# Altium schematic sheet 12V_to_5V.SchDoc: 12V to 5V Converter
size B; DocumentNumber: 37; SheetNumber: 37; SheetTotal: 46
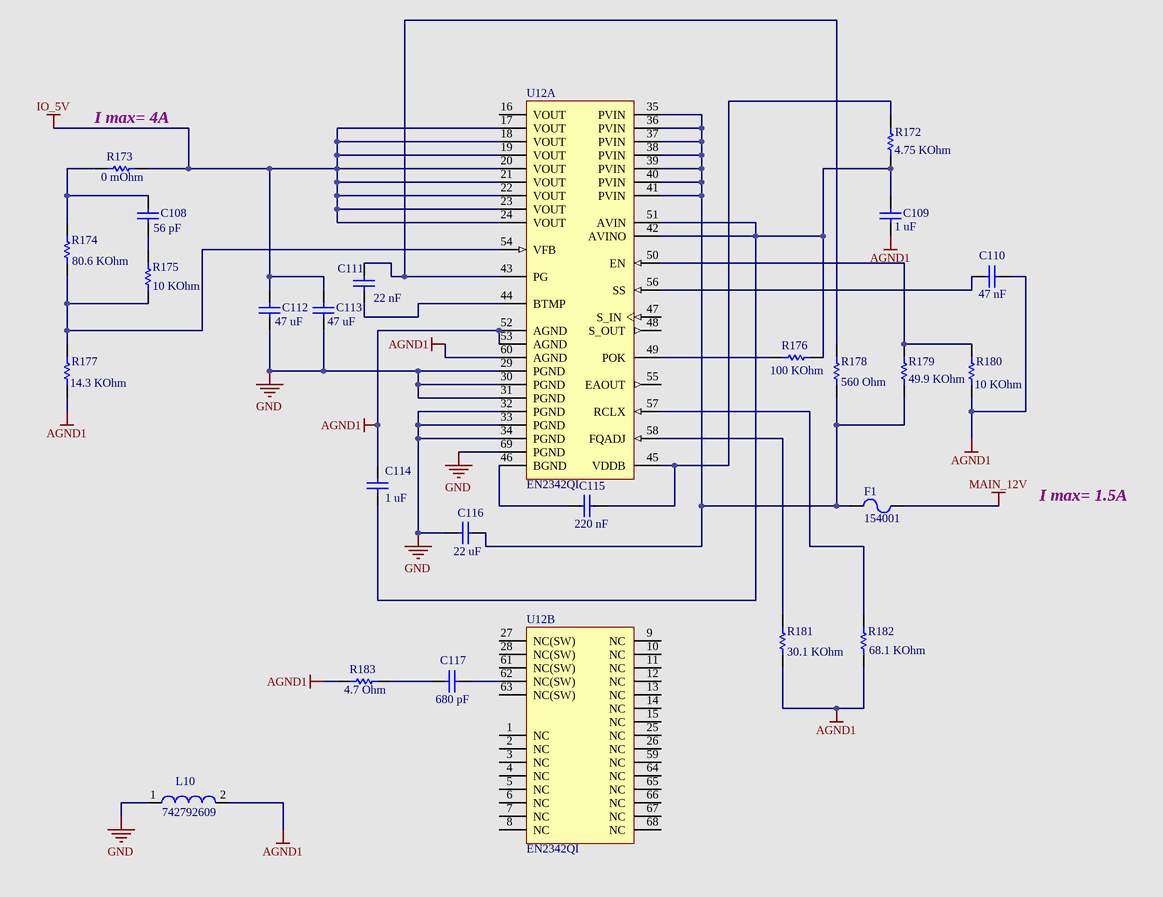
[diagram p0: 12V_to_5V.SchDoc]

## Parts
(Parts that share a designator on the sheet are numbered #1, #2 ... from top to bottom, then left to right.)
C108  Capacitance: 56 pF  [CAPC1005X33X20ML05T10]  (hidden comment: GRM1535C1H560JDD5D)
C109  Capacitance: 1 uF  [CAPC1005X33X10LL5]  (hidden comment: CGB2A1X5R1E105K033BC)
C110  Capacitance: 47 nF  [CAPC1005X55X25NL05T10]  (hidden comment: GRM155R71E473KA88D)
C111  Capacitance: 22 nF  [CAPC1005X55X25ML05T10]  (hidden comment: GRM155R71E223KA61D)
C112  Capacitance: 47 uF  [CAPC3216X180X20ML20]  (hidden comment: C3216X5R1A476M160AB)
C113  Capacitance: 47 uF  [CAPC3216X180X20ML20]  (hidden comment: C3216X5R1A476M160AB)
C114  Capacitance: 1 uF  [CAPC1005X33X10LL5]  (hidden comment: CGB2A1X5R1E105K033BC)
C115  Capacitance: 220 nF  [CAPC1005X55X25NL05T10]  (hidden comment: GRM155R61A224KE19D)
C116  Capacitance: 22 uF  [CAPC3216X180X55ML20T25]  (hidden comment: GRM31CR61E226KE15L)
C117  Capacitance: 680 pF  [CAPC1005X55X25ML05T10]  (hidden comment: GRM155R71H681KA01D)
F1  154001  [LFUS-0154001.DR_V]
L10  742792609  [SMD-0603]
R172  Resistance: 4.75 KOhm  [RESC1005X40X25ML05T05]  (hidden comment: ERJ-2RKF4751X)
R173  Resistance: 0 mOhm  [RESC1005X40X25ML05T05]  (hidden comment: ERJ-2GE0R00X)
R174  Resistance: 80.6 KOhm  [RESC1005X40X25ML05T05]  (hidden comment: ERJ-2RKF8062X)
R175  Resistance: 10 KOhm  [RESC1005X40X25NL05T05]  (hidden comment: ERJ-2RKF1002X)
R176  Resistance: 100 KOhm  [RESC1005X40X25LL05T05]  (hidden comment: ERJ-2RKF1003X)
R177  Resistance: 14.3 KOhm  [RESC1005X40X25LL05T05]  (hidden comment: ERJ-2RKF1432X)
R178  Resistance: 560 Ohm  [RESC1005X40X25ML05T05]  (hidden comment: ERJ-2GEJ561x)
R179  Resistance: 49.9 KOhm  [RESC1005X40X25LL05T05]  (hidden comment: ERJ-2RKF4992X)
R180  Resistance: 10 KOhm  [RESC1005X40X25NL05T05]  (hidden comment: ERJ-2RKF1002X)
R181  Resistance: 30.1 KOhm  [RESC1005X40X25LL05T05]  (hidden comment: CRCW040230K1FKED)
R182  Resistance: 68.1 KOhm  [RESC1005X40X25LL05T05]  (hidden comment: ERJ-2RKF6812X)
R183  Resistance: 4.7 Ohm  [RESC2013X70X40LL20T20]  (hidden comment: ERJ-6RQF4R7V)
U12#1  EN2342QI  [ALTR-QFN-68_A-305_D1-210_V]  (part A of 2)
U12#2  EN2342QI  [ALTR-QFN-68_A-305_D1-210_V]  (part B of 2)

## Nets
AGND1: C109.1 C110.1 C114.2 L10.2 R177.1 R180.1 R181.1 R182.1 R183.1 U12#1.52(AGND) U12#1.53(AGND) U12#1.60(AGND)
GND: C112.1 C113.1 C116.1 L10.1 U12#1.29(PGND) U12#1.30(PGND) U12#1.31(PGND) U12#1.32(PGND) U12#1.33(PGND) U12#1.34(PGND) U12#1.69(PGND)
IO_5V: C112.2 C113.2 R173.2 U12#1.17(VOUT) U12#1.18(VOUT) U12#1.19(VOUT) U12#1.20(VOUT) U12#1.21(VOUT) U12#1.22(VOUT) U12#1.23(VOUT) U12#1.24(VOUT)
MAIN_12V: F1.2
NetC108_1: C108.1 R175.2
NetC108_2: C108.2 R173.1 R174.2
NetC109_2: C109.2 C114.1 R172.1 R176.2 U12#1.42(AVINO) U12#1.51(AVIN)
NetC110_2: C110.2 U12#1.56(SS)
NetC111_1: C111.1 U12#1.44(BTMP)
NetC111_2: C111.2 R178.2 U12#1.43(PG)
NetC115_1: C115.1 U12#1.46(BGND)
NetC115_2: C115.2 R172.2 U12#1.45(VDDB)
NetC116_2: C116.2 F1.1 R178.1 R179.1 U12#1.35(PVIN) U12#1.36(PVIN) U12#1.37(PVIN) U12#1.38(PVIN) U12#1.39(PVIN) U12#1.40(PVIN) U12#1.41(PVIN)
NetC117_1: C117.1 R183.2
NetC117_2: C117.2 U12#2.62(NC(SW))
NetR174_1: R174.1 R175.1 R177.2 U12#1.54(VFB)
NetR176_1: R176.1 U12#1.49(POK)
NetR179_2: R179.2 R180.2 U12#1.50(EN)
NetR181_2: R181.2 U12#1.58(FQADJ)
NetR182_2: R182.2 U12#1.57(RCLX)

Not connected (* = marked no-connect by the designer): U12#1 16(VOUT) 47(S_IN) 48(S_OUT) 55(EAOUT); U12#2 1(NC) 2(NC) 3(NC) 4(NC) 5(NC) 6(NC) 7(NC) 8(NC) 9(NC) 10(NC) 11(NC) 12(NC) 13(NC) 14(NC) 15(NC) 25(NC) 26(NC) 27(NC(SW)) 28(NC(SW)) 59(NC) 61(NC(SW)) 63(NC(SW)) 64(NC) 65(NC) 66(NC) 67(NC) 68(NC)

## Notes on the sheet
- (near R173) I max= 4A
- I max= 1.5A
- Title
- Size:
- Date:
- B
- Number:
- Time:
- Revision:
- Sheet
- of
- File:

## Library data of the parts
C108 = CMP-2008-04685-4: Chip Capacitor, 56 pF, +/- 5%, 50 V, -55 to 125 degC, 0402 (1005 Metric), RoHS, Tape and Reel; Manufacturer: Basic Passives; Voltage Rating: 50 V; Case\/Package: 0402; Type (Capacitors): C0G; Mounting Technology: Surface Mount; Packaging: Cut Tape; ComponentLink1Description: Manufacturer URL; Tolerance: 5%; Length: 0.039 inch; PartNumber: GRM1535C1H560JDD5D; RoHSCompliant: true; PackageDescription: 2-Pin Surface Mount Device, Body 1 x 0.5 mm; ComponentLink1URL: http://www.murata.com/; Width: 0.02 inch; Case Code (Imperial): 0402; Max Operating Temperature: 125 degC; Case Code (Metric): 1005; Min Operating Temperature: -55 degC; Package Quantity: 1; Height: 0.3 mm; ComponentLink2Description: Datasheet; PackageReference: 0402; DatasheetVersion: 01/2013; ComponentLink2URL: http://search.murata.co.jp/Ceramy/image/img/A01X/G101/ENG/GRM1535C1H560JDD5-01.pdf; Voltage Rating (DC): 50 V; Pins: 2; Radiation Hardening: No; Mount: Surface Mount
C109 C114 = CMP-1663-00006-2: Chip Capacitor, 1 uF, +/- 10%, 25 V, -55 to 85 degC, 0402 (1005 Metric), RoHS, Tape and Reel; Tolerance: 10%; PackageDescription: 2-Pin Surface Mount Device, Body 1 x 0.5 mm; PartNumber: CGB2A1X5R1E105K033BC; Case Code (Metric): 1005; DatasheetVersion: 04/2015; RoHSCompliant: True; Max Operating Temperature: 85 degC; ComponentLink2URL: https://product.tdk.com/info/en/catalog/datasheets/mlcc_commercial_lowprofile_en.pdf; Package Quantity: 1; Width: 0.02 inch; Case/Package: 0402; Case Code (Imperial): 0402; Packaging: Tape and Reel; Length: 0.039 inch; Min Operating Temperature: -55 degC; Mounting Technology: Surface Mount; ComponentLink2Description: Datasheet; ComponentLink1URL: http://www.tdk.com/; ComponentLink1Description: Manufacturer URL
C110 = CMP-2008-04630-4: Chip Capacitor, 47 nF, +/- 10%, 25 V, -55 to 125 degC, 0402 (1005 Metric), RoHS, Tape and Reel; Manufacturer: Basic Passives; Voltage Rating: 25 V; Case\/Package: 0402; Type (Capacitors): X7R; Width: 0.5 mm; ComponentLink1Description: Manufacturer URL; REACH SVHC: No SVHC; Case Code (Metric): 1005; Package Quantity: 10000; ComponentLink1URL: http://www.murata.com/; PartNumber: GRM155R71E473KA88D; Max Operating Temperature: 125 degC; RoHSCompliant: true; Min Operating Temperature: -55 degC; Height: 0.5 mm; Mounting Technology: Surface Mount; Length: 1 mm; Case Code (Imperial): 0402; PackageDescription: 2-Pin Surface Mount Device, Body 1 x 0.5 mm; Packaging: Tape and Reel; Tolerance: 10%; Lead Pitch: 2 mm; ComponentLink2Description: Datasheet; ComponentLink2URL: http://search.murata.co.jp/Ceramy/image/img/A01X/G101/ENG/GRM155R71E473KA88-01.pdf; Voltage Rating (DC): 25 V; DatasheetVersion: 02/2016; Radiation Hardening: No; Mount: Surface Mount; PackageReference: 0402; Pins: 2
C111 = CMP-2008-04622-4: Chip Capacitor, 22 nF, +/- 10%, 25 V, -55 to 125 degC, 0402 (1005 Metric), RoHS, Tape and Reel; Manufacturer: Basic Passives; Voltage Rating: 25 V; Case\/Package: 0402; Type (Capacitors): X7R; ComponentLink1Description: Manufacturer URL; Width: 0.5 mm; Height: 0.5 mm; Case Code (Imperial): 0402; Packaging: Tape and Reel; Package Quantity: 10000; Case Code (Metric): 1005; Min Operating Temperature: -55 degC; Tolerance: 10%; PackageDescription: 2-Pin Surface Mount Device, Body 1 x 0.5 mm; PartNumber: GRM155R71E223KA61D; Max Operating Temperature: 125 degC; Length: 1 mm; Mounting Technology: Surface Mount; ComponentLink1URL: http://www.murata.com/; RoHSCompliant: true; Radiation Hardening: No; Mount: Surface Mount; Pins: 2; PackageReference: 0402; Voltage Rating (DC): 25 V; ComponentLink2Description: Datasheet; ComponentLink2URL: http://search.murata.co.jp/Ceramy/image/img/A01X/G101/ENG/GRM155R71E223KA61-01.pdf; Lead Pitch: 2 mm; DatasheetVersion: 02/2016
C112 C113 = CMP-1663-00005-1: Chip Capacitor, 47 uF, +/- 20%, 10 V, -55 to 85 degC, 1206 (3216 Metric), RoHS, Tape and Reel; Voltage Rating (DC): 10 V; Type (Capacitors): X5R; Case\/Package: 1206; Tolerance: 20%; Voltage Rating: 10 V; Packaging: Tape and Reel; ComponentLink2URL: https://product.tdk.com/info/en/catalog/datasheets/mlcc_commercial_general_en.pdf; Min Operating Temperature: -55 degC; Length: 3.2 mm; Radiation Hardening: No; Mounting Technology: Surface Mount; PackageDescription: 2-Pin Surface Mount Device, Body 3.2 x 1.6 mm; Max Operating Temperature: 85 degC; Case Code (Metric): 3216; ComponentLink1URL: http://www.tdk.com/; DatasheetVersion: 03/2015; Mount: Surface Mount; Case Code (Imperial): 1206; Package Quantity: 2000; ComponentLink2Description: Datasheet; PackageReference: 3216; Height: 1.6 mm; RoHSCompliant: true; Width: 1.6 mm; ComponentLink1Description: Manufacturer URL
C115 = CMP-2008-04561-4: Chip Capacitor, 220 nF, +/- 10%, 10 V, -55 to 85 degC, 0402 (1005 Metric), RoHS, Tape and Reel; Manufacturer: Basic Passives; Voltage Rating: 10 V; Case\/Package: 0402; Type (Capacitors): X5R; ComponentLink1URL: http://www.murata.com/; Package Quantity: 1; Tolerance: 10%; Mounting Technology: Surface Mount; RoHSCompliant: true; PartNumber: GRM155R61A224KE19D; Max Operating Temperature: 85 degC; Case Code (Imperial): 0402; Length: 1 mm; Packaging: Tape and Reel; Min Operating Temperature: -55 degC; PackageDescription: 2-Pin Surface Mount Device, Body 1 x 0.5 mm; Height: 0.5 mm; Case Code (Metric): 1005; REACH SVHC: No SVHC; ComponentLink1Description: Manufacturer URL; Width: 0.5 mm; ComponentLink2URL: http://search.murata.co.jp/Ceramy/image/img/A01X/G101/ENG/GRM155R61A224KE19-01.pdf; Radiation Hardening: No; Pins: 2; Voltage Rating (DC): 10 V; DatasheetVersion: 03/2016; Mount: Surface Mount; PackageReference: 0402; ComponentLink2Description: Datasheet
C116 = CMP-1662-00010-2: Chip Capacitor, 22 uF, +/- 10%, 25 V, -55 to 85 degC, 1206 (3216 Metric), RoHS, Tape and Reel; Voltage Rating (DC): 25 V; Case\/Package: 1206; Type (Capacitors): X5R; Tolerance: 10%; Max Operating Temperature: 85 degC; Package Quantity: 2000; Voltage Rating: 25 V; Case Code (Metric): 3216; Length: 3.2 mm; PackageDescription: 2-Pin Surface Mount Device, Body 3.2 x 1.6 mm; ComponentLink1Description: Manufacturer URL; Case Code (Imperial): 1206; ComponentLink1URL: http://www.murata.com/; Radiation Hardening: No; Height: 1.6 mm; Width: 1.6 mm; DatasheetVersion: 03/2016; Min Operating Temperature: -55 degC; Mount: Surface Mount; REACH SVHC: No SVHC; PackageReference: 1206; ComponentLink2URL: http://search.murata.co.jp/Ceramy/image/img/A01X/G101/ENG/GRM31CR61E226KE15-01.pdf; Packaging: Tape and Reel; RoHSCompliant: true; ComponentLink2Description: Datasheet; Mounting Technology: Surface Mount; PartNumber: GRM31CR61E226KE15L; Pins: 2
C117 = CMP-2008-04665-4: Chip Capacitor, 680 pF, +/- 10%, 50 V, -55 to 125 degC, 0402 (1005 Metric), RoHS, Tape and Reel; Manufacturer: Basic Passives; Voltage Rating: 50 V; Type (Capacitors): X7R; Case\/Package: 0402; Tolerance: 10%; Min Operating Temperature: -55 degC; RoHSCompliant: true; Case Code (Imperial): 0402; Length: 1 mm; PartNumber: GRM155R71H681KA01D; Package Quantity: 10000; ComponentLink1Description: Manufacturer URL; Height: 0.5 mm; Case Code (Metric): 1005; PackageDescription: 2-Pin Surface Mount Device, Body 1 x 0.5 mm; Width: 0.5 mm; Mounting Technology: Surface Mount; ComponentLink1URL: http://www.murata.com/; Max Operating Temperature: 125 degC; Packaging: Tape and Reel; Mount: Surface Mount; ComponentLink2URL: http://search.murata.co.jp/Ceramy/image/img/A01X/G101/ENG/GRM155R71H681KA01-01.pdf; ComponentLink2Description: Datasheet; PackageReference: 0402; Radiation Hardening: No; Pins: 2; Lead Pitch: 2 mm; Voltage Rating (DC): 50 V; DatasheetVersion: 02/2016
F1 = CMP-1700-00001-3: 154 Series OMNI-BLOK(R) Fuse and Holder Assembly, 125 VAC, 125 VDC, 1 A, -55 to 125 degC, 2-Pin SMD, RoHS; ComponentLink2URL: http://www.littelfuse.com/~/media/electronics/datasheets/fuses/littelfuse_fuse_154_154t_154l_154tl_datasheet.pdf.pdf; Mounting Technology: Surface Mount; ComponentLink1URL: http://www.littelfuse.com/; ComponentLink2Description: Datasheet; ComponentLink1Description: Manufacturer URL; PartNumber: 154001; PackageDescription: 2-Pin Surface Mount Device, Body 9.73 x 5.03 mm; DatasheetVersion: Rev. Apr-16; Pins: 2; Min Operating Temperature: -55 degC; RoHSCompliant: False; Mount: Surface Mount; Max Operating Temperature: 125 degC
L10 = CMP-0220-00193-1: SMD EMI Suppression Ferrite Bead WE-CBF, Z = 30 Ohm; Impedance: 30 Ohm; ComponentLink2URL: http://www.we-online.de/katalog/media/pdf/742792609.pdf; ComponentLink1URL: http://www.we-online.com; ComponentLink2Description: Datasheet; PackageDescription: Chip Inductor, 2-Leads, Body 1.6 x 0.8 mm; ComponentLink1Description: Manufacturer Link; PackageReference: SMD-0603; DatasheetVersion: Dec-2005; PackageVersion: 2009
R172 = CMP-2002-00956-3: Chip Resistor, 4.75 KOhm, +/- 1%, 100 mW, -55 to 155 degC, 0402 (1005 Metric), RoHS, Tape and Reel; Manufacturer: Basic Passives; Power Rating: 100 mW; Voltage Rating: 50 V; Case\/Package: 0402; Min Operating Temperature: -55 degC; RoHSCompliant: true; Package Quantity: 10000; Packaging: Tape and Reel; Mounting Technology: Surface Mount; REACH SVHC: Yes; Height: 0.35 mm; Mount: Surface Mount; PackageDescription: 2-Pin Surface Mount Device, Body 1 x 0.5 mm; Case Code (Metric): 1005; Max Operating Temperature: 155 degC; Case Code (Imperial): 0402; Length: 1 mm; ComponentLink1Description: Manufacturer URL; Tolerance: 1%; PartNumber: ERJ-2RKF4751X; ComponentLink1URL: http://www.panasonic.com/; Width: 0.5 mm; PackageReference: 0402; Pins: 2; ComponentLink2Description: Datasheet; DatasheetVersion: 04/2015; ComponentLink2URL: http://industrial.panasonic.com/cdbs/www-data/pdf/RDA0000/AOA0000C86.pdf; Radiation Hardening: No
R173 = CMP-2002-00429-3: Chip Resistor, 0 mOhm, +/- 5%, 100 mW, -55 to 155 degC, 0402 (1005 Metric), RoHS, Tape and Reel; Manufacturer: Basic Passives; Power Rating: 100 mW; Voltage Rating: 50 V; Case\/Package: 0402; Max Operating Temperature: 155 degC; Tolerance: 5%; PartNumber: ERJ-2GE0R00X; Case Code (Imperial): 0402; Package Quantity: 10000; Length: 1 mm; Mounting Technology: Surface Mount; ComponentLink1URL: http://www.panasonic.com/; Height: 0.35 mm; Width: 0.5 mm; Min Operating Temperature: -55 degC; Case Code (Metric): 1005; RoHSCompliant: true; REACH SVHC: Unknown; ComponentLink1Description: Manufacturer URL; Packaging: Tape and Reel; Mount: Surface Mount; PackageDescription: 2-Pin Surface Mount Device, Body 1 x 0.5 mm; PackageReference: 0402; ComponentLink2URL: http://industrial.panasonic.com/cdbs/www-data/pdf/RDA0000/AOA0000C84.pdf; DatasheetVersion: 03/2015; Radiation Hardening: No; Pins: 2; ComponentLink2Description: Datasheet
R174 = CMP-2002-01074-3: Chip Resistor, 80.6 KOhm, +/- 1%, 100 mW, -55 to 155 degC, 0402 (1005 Metric), RoHS, Tape and Reel; Manufacturer: Basic Passives; Voltage Rating: 50 V; Power Rating: 100 mW; Case\/Package: 0402; REACH SVHC: No SVHC; Min Operating Temperature: -55 degC; Max Operating Temperature: 155 degC; ComponentLink1Description: Manufacturer URL; PackageDescription: 2-Pin Surface Mount Device, Body 1 x 0.5 mm; ComponentLink1URL: http://www.panasonic.com/; PartNumber: ERJ-2RKF8062X; Case Code (Metric): 1005; Packaging: Tape and Reel; Mount: Surface Mount; Tolerance: 1%; Package Quantity: 1; RoHSCompliant: true; Mounting Technology: Surface Mount; Height: 0.35 mm; Width: 0.5 mm; Case Code (Imperial): 0402; Length: 1 mm; ComponentLink2Description: Datasheet; Pins: 2; DatasheetVersion: 04/2015; ComponentLink2URL: http://industrial.panasonic.com/cdbs/www-data/pdf/RDA0000/AOA0000C86.pdf; PackageReference: 0402
R175 R180 = CMP-2002-00607-3: Chip Resistor, 10 KOhm, +/- 1%, 100 mW, -55 to 155 degC, 0402 (1005 Metric), RoHS, Tape and Reel; Manufacturer: Basic Passives; Voltage Rating: 50 V; Power Rating: 100 mW; Case\/Package: 0402; Case Code (Imperial): 0402; Min Operating Temperature: -55 degC; PartNumber: ERJ-2RKF1002X; Mounting Technology: Surface Mount; Length: 1 mm; Packaging: Tape and Reel; ComponentLink1Description: Manufacturer URL; Mount: Surface Mount; Package Quantity: 10000; Max Operating Temperature: 155 degC; Case Code (Metric): 1005; Height: 0.35 mm; ComponentLink1URL: http://www.panasonic.com/; Tolerance: 1%; REACH SVHC: Yes; RoHSCompliant: true; Width: 0.5 mm; PackageDescription: 2-Pin Surface Mount Device, Body 1 x 0.5 mm; Radiation Hardening: No; PackageReference: 0402; ComponentLink2Description: Datasheet; DatasheetVersion: 04/2015; ComponentLink2URL: http://industrial.panasonic.com/cdbs/www-data/pdf/RDA0000/AOA0000C86.pdf; Pins: 2
R176 = CMP-2002-00608-3: Chip Resistor, 100 KOhm, +/- 1%, 100 mW, -55 to 155 degC, 0402 (1005 Metric), RoHS, Tape and Reel; Manufacturer: Basic Passives; Voltage Rating: 50 V; Power Rating: 100 mW; Case\/Package: 0402; Height: 0.35 mm; ComponentLink1Description: Manufacturer URL; Packaging: Tape and Reel; Min Operating Temperature: -55 degC; RoHSCompliant: true; PackageDescription: 2-Pin Surface Mount Device, Body 1 x 0.5 mm; Mount: Surface Mount; Package Quantity: 10000; Max Operating Temperature: 155 degC; ComponentLink1URL: http://www.panasonic.com/; Tolerance: 1%; Mounting Technology: Surface Mount; PartNumber: ERJ-2RKF1003X; Case Code (Metric): 1005; Case Code (Imperial): 0402; REACH SVHC: Yes; Length: 1 mm; Width: 0.5 mm; DatasheetVersion: 04/2015; Pins: 2; ComponentLink2Description: Datasheet; ComponentLink2URL: http://industrial.panasonic.com/cdbs/www-data/pdf/RDA0000/AOA0000C86.pdf; PackageReference: 0402; Radiation Hardening: No
R177 = CMP-2002-00683-3: Chip Resistor, 14.3 KOhm, +/- 1%, 100 mW, -55 to 155 degC, 0402 (1005 Metric), RoHS, Tape and Reel; Manufacturer: Basic Passives; Voltage Rating: 50 V; Power Rating: 100 mW; Case\/Package: 0402; Max Operating Temperature: 155 degC; ComponentLink1Description: Manufacturer URL; Packaging: Tape and Reel; Height: 0.35 mm; Mounting Technology: Surface Mount; ComponentLink1URL: http://www.panasonic.com/; Width: 0.5 mm; PackageDescription: 2-Pin Surface Mount Device, Body 1 x 0.5 mm; Length: 1 mm; Min Operating Temperature: -55 degC; RoHSCompliant: true; Case Code (Metric): 1005; REACH SVHC: Yes; PartNumber: ERJ-2RKF1432X; Case Code (Imperial): 0402; Mount: Surface Mount; Package Quantity: 1; Tolerance: 1%; ComponentLink2URL: http://industrial.panasonic.com/cdbs/www-data/pdf/RDA0000/AOA0000C86.pdf; ComponentLink2Description: Datasheet; DatasheetVersion: 04/2015; Pins: 2; PackageReference: 0402
R178 = CMP-2002-00557-3: Chip Resistor, 560 Ohm, +/- 5%, 100 mW, -55 to 155 degC, 0402 (1005 Metric), RoHS, Tape and Reel; Manufacturer: Basic Passives; Voltage Rating: 50 V; Power Rating: 100 mW; Case\/Package: 0402; Mounting Technology: Surface Mount; Case Code (Imperial): 0402; PackageDescription: 2-Pin Surface Mount Device, Body 1 x 0.5 mm; PartNumber: ERJ-2GEJ561x; RoHSCompliant: true; Case Code (Metric): 1005; Tolerance: 5%; ComponentLink1Description: Manufacturer URL; Width: 0.02 inch; REACH SVHC: Unknown; Mount: Surface Mount; Length: 0.039 inch; Package Quantity: 10000; Packaging: Tape and Reel; Height: 0.016 inch; ComponentLink1URL: http://www.panasonic.com/; Min Operating Temperature: -55 degC; Max Operating Temperature: 155 degC; ComponentLink2URL: http://industrial.panasonic.com/cdbs/www-data/pdf/RDA0000/AOA0000C84.pdf; ComponentLink2Description: Datasheet; PackageReference: 0402; Radiation Hardening: No; DatasheetVersion: 03/2015; Pins: 2
R179 = CMP-2002-00967-3: Chip Resistor, 49.9 KOhm, +/- 1%, 100 mW, -55 to 155 degC, 0402 (1005 Metric), RoHS, Tape and Reel; Manufacturer: Basic Passives; Voltage Rating: 50 V; Power Rating: 100 mW; Case\/Package: 0402; Case Code (Metric): 1005; Case Code (Imperial): 0402; Min Operating Temperature: -55 degC; Length: 1 mm; Height: 0.35 mm; ComponentLink1URL: http://www.panasonic.com/; PackageDescription: 2-Pin Surface Mount Device, Body 1 x 0.5 mm; PartNumber: ERJ-2RKF4992X; RoHSCompliant: true; Tolerance: 1%; Width: 0.5 mm; ComponentLink1Description: Manufacturer URL; Package Quantity: 10000; Packaging: Tape and Reel; REACH SVHC: No SVHC; Mount: Surface Mount; Mounting Technology: Surface Mount; Max Operating Temperature: 155 degC; Pins: 2; DatasheetVersion: 04/2015; ComponentLink2URL: http://industrial.panasonic.com/cdbs/www-data/pdf/RDA0000/AOA0000C86.pdf; Radiation Hardening: No; PackageReference: 0402; ComponentLink2Description: Datasheet
R181 = CMP-2002-08506-3: Chip Resistor, 30.1 KOhm, +/- 1%, 63 mW, -55 to 155 degC, 0402 (1005 Metric), RoHS, Tape and Reel; Manufacturer: Basic Passives; Power Rating: 63 mW; Voltage Rating: 50 V; Case\/Package: 0402; Mount: Surface Mount; Case Code (Metric): 1005; RoHSCompliant: true; Packaging: Tape and Reel; Max Operating Temperature: 155 degC; Mounting Technology: Surface Mount; PartNumber: CRCW040230K1FKED; Tolerance: 1%; PackageDescription: 2-Pin Surface Mount Device, Body 1 x 0.5 mm; Min Operating Temperature: -55 degC; ComponentLink1URL: http://www.vishay.com/; Case Code (Imperial): 0402; Height: 0.35 mm; Width: 0.5 mm; ComponentLink1Description: Manufacturer URL; Package Quantity: 10000; Length: 1 mm; REACH SVHC: Unknown; DatasheetVersion: 06/2012; ComponentLink2URL: http://www.vishay.com/docs/20035/dcrcwe3.pdf; Weight: 2.3E-05oz; PackageReference: 0402; Radiation Hardening: No; Pins: 2; ComponentLink2Description: Datasheet
R182 = CMP-2002-01039-3: Chip Resistor, 68.1 KOhm, +/- 1%, 100 mW, -55 to 155 degC, 0402 (1005 Metric), RoHS, Tape and Reel; Manufacturer: Basic Passives; Power Rating: 100 mW; Voltage Rating: 50 V; Case\/Package: 0402; RoHSCompliant: true; Case Code (Imperial): 0402; PackageDescription: 2-Pin Surface Mount Device, Body 1 x 0.5 mm; Height: 0.35 mm; Case Code (Metric): 1005; PartNumber: ERJ-2RKF6812X; Mount: Surface Mount; Mounting Technology: Surface Mount; Package Quantity: 10000; Max Operating Temperature: 155 degC; REACH SVHC: Yes; Length: 1 mm; ComponentLink1URL: http://www.panasonic.com/; Width: 0.5 mm; Packaging: Tape and Reel; Tolerance: 1%; ComponentLink1Description: Manufacturer URL; Min Operating Temperature: -55 degC; ComponentLink2URL: http://industrial.panasonic.com/cdbs/www-data/pdf/RDA0000/AOA0000C86.pdf; DatasheetVersion: 04/2015; ComponentLink2Description: Datasheet; Pins: 2; PackageReference: 0402
R183 = CMP-1665-00033-1: Chip Resistor, 4.7 Ohm, +/- 1%, 125 mW, -55 to 125 degC, 0805 (2012 Metric), RoHS, Tape and Reel; Power Rating: 125 mW; Case\/Package: 0805; Max Operating Temperature: 125 degC; PackageDescription: 2-Pin Surface Mount Device, Body 2 x 1.5 mm; PartNumber: ERJ-6RQF4R7V; Height: 0.028 inch; Case Code (Metric): 2012; Min Operating Temperature: -55 degC; Case Code (Imperial): 0805; Package Quantity: 5000; Tolerance: 1%; ComponentLink1URL: http://www.panasonic.com/; Packaging: Tape and Reel; Length: 0.079 inch; Mount: Surface Mount; RoHSCompliant: true; Width: 0.049 inch; ComponentLink1Description: Manufacturer URL; REACH SVHC: No SVHC; Mounting Technology: Surface Mount; Pins: 2; ComponentLink2URL: http://industrial.panasonic.com/cdbs/www-data/pdf/RDA0000/AOA0000C86.pdf; ComponentLink2Description: Datasheet; PackageReference: 0805; Radiation Hardening: No; DatasheetVersion: 04/2015
U12#1 U12#2 = CMP-1689-00003-3: PowerSoC Voltage Mode Synchronous PWM Buck with Integrated Inductor, 4 A, 4.5 to 14 V Input, 0.75 to 5 V Output, -40 to 85 degC, 68-Pin QFN, RoHS, Tape and Reel; PartNumber: EN2342QI; ComponentLink1URL: https://www.altera.com/; ComponentLink1Description: Manufacturer URL; DatasheetVersion: Rev. F; ComponentLink2Description: Datasheet; Mounting Technology: Surface Mount; ComponentLink2URL: https://www.altera.com/content/dam/altera-www/global/en_US/pdfs/literature/ds/en2342qi_09520.pdf; PackageDescription: 68-Pin Quad Flat No-lead Package, Body 11 x 8 mm, Pitch 0.5 mm, Thermal Pad 2.1 x 6 mm; Max Operating Temperature: 85 degC; RoHSCompliant: True; Min Operating Temperature: -40 degC; Pins: 68; Mount: Surface Mount; Packaging: Cut Tape; Package Quantity: 1